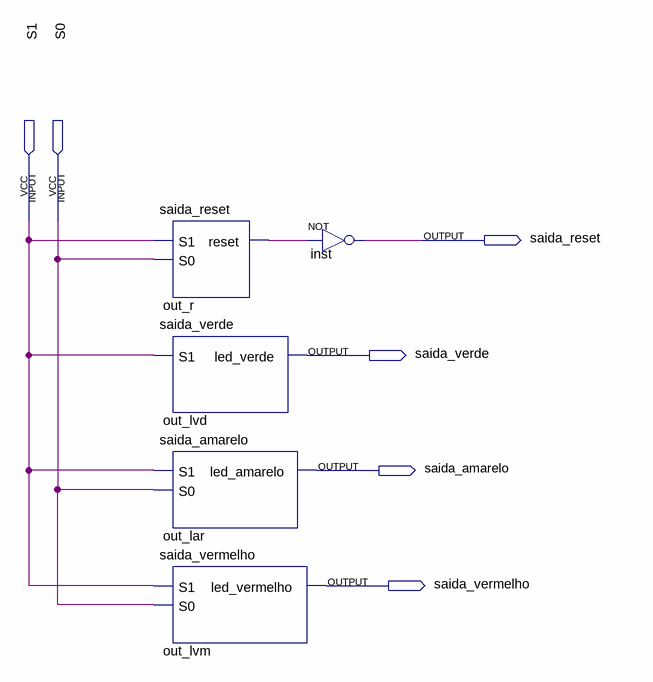
[diagram p0: schematic sheet]
// Quartus schematic controle_saida.bdf as structural Verilog: 5 symbols, 6 pins
module controle_saida (
  input  S1,
  input  S0,
  output saida_reset,
  output saida_verde,
  output saida_amarelo,
  output saida_vermelho
);

  wire out_r_reset;

  saida_reset out_r (.S1(S1), .S0(S0), .reset(out_r_reset));
  saida_verde out_lvd (.S1(S1), .led_verde(saida_verde));
  saida_amarelo out_lar (.S1(S1), .S0(S0), .led_amarelo(saida_amarelo));
  saida_vermelho out_lvm (.S1(S1), .S0(S0), .led_vermelho(saida_vermelho));
  not inst (saida_reset, out_r_reset);
endmodule
